# EAGLE design vr (EAGLE 4.16)
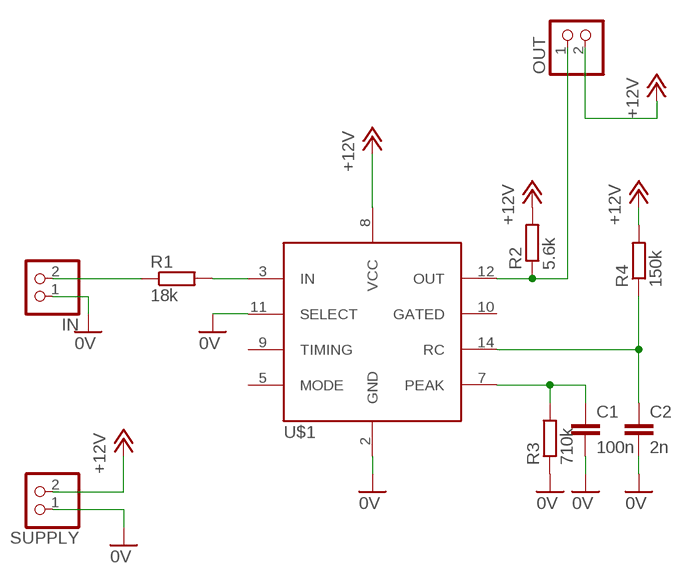
[diagram p0: schematic, sheet 1]

## Parts
C1  100n  C-EU075-032X103  [C075-032X103]
C2  2n  C-EU025-024X044  [C025-024X044]
IN  PINHD-1X2  [1X02]
OUT  PINHD-1X2  [1X02]
R1  18k  R-EU_0204/5  [0204/5]
R2  5.6k  R-EU_0207/10  [0207/10]
R3  710k  R-EU_0204/7  [0204/7]
R4  150k  R-EU_0204/7  [0204/7]
SUPPLY  PINHD-1X2  [1X02]
U$1  LM1815  [DIL14]

## Nets
0V: C1.2 C2.2 IN.1 R3.1 SUPPLY.1 U$1.2(GND) U$1.11(SELECT)
+12V: OUT.2 R2.2 R4.2 SUPPLY.2 U$1.8(VCC)
N$1: R1.2 U$1.3(IN)
N$2: OUT.1 R2.1 U$1.12(OUT)
N$3: C1.1 R3.2 U$1.7(PEAK)
N$5: C2.1 R4.1 U$1.14(RC)
N$6: IN.2 R1.1
Unconnected: U$1.5(MODE) U$1.9(TIMING) U$1.10(GATED)

## Library data of the parts
C1 C2 = rcl:C-EU: CAPACITOR, European symbol
IN OUT SUPPLY = pinhead:PINHD-1X2: PIN HEADER
R1-R4 = rcl:R-EU_: RESISTOR, European symbol
U$1 = rnie04:LM1815

## Board
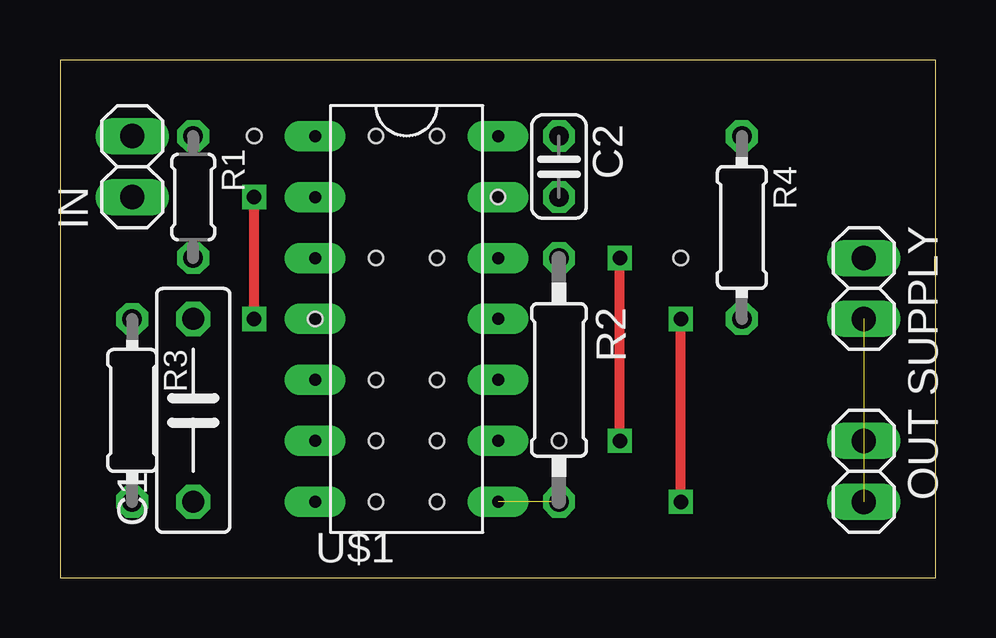
[diagram p1: board, top side]
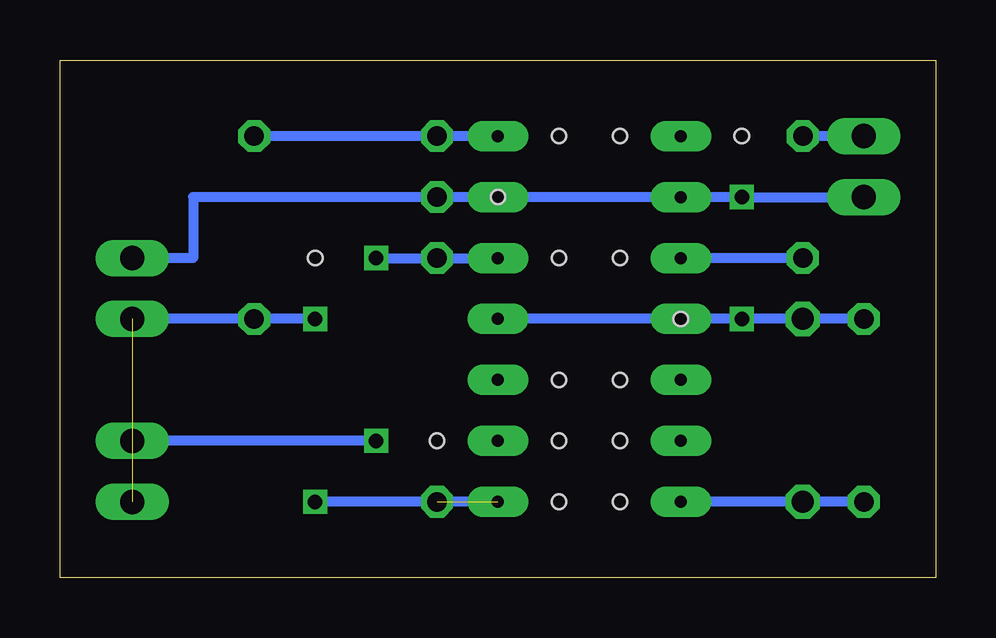
[diagram p2: board, bottom side, seen from below]

Size 36.5 x 21.58 mm. Coordinates in mm from the lower left corner, seen from the top.
Outline: 0,0 36.5,0 36.5,21.58 0,21.58 0,0
Copper layers (1*16): Top 0.035mm / dielectric 1.5mm / Bottom 0.035mm
Design rules "default": minimum track width 10mil, minimum drill 24mil, track to track 8mil, track to pad 8mil, pad to pad 8mil, via to via 8mil, smd to smd 8mil, copper to edge 40mil, drill to drill 8mil, minimum pad ring 10mil, minimum via ring 8mil, stop-mask expansion 4mil, vias tented up to drill 0mil, thermal gap 10mil
Holes 0.6 mm at 13.17,3.17 13.17,5.71 13.17,8.25 13.17,13.33 13.17,18.41 15.71,18.41 15.71,13.33 15.71,8.25 15.71,5.71 15.71,3.17 25.87,13.33 20.79,5.71 18.25,15.87 10.63,10.79 8.09,18.41

### Footprints (pad centres in the part's own frame; a part is rotated, then mirrored left to right if it is on the bottom)
C075-032X103 = drill 0.914 octagon: 1 -3.81,0; 2 3.81,0
C025-024X044 = drill 0.813 octagon: 1 -1.27,0; 2 1.27,0
1X02 = drill 1.016 long: 1 -1.27,0; 2 1.27,0
0204/5 = drill 0.813 octagon: 1 -2.54,0; 2 2.54,0
0207/10 = drill 0.813 octagon: 1 -5.08,0; 2 5.08,0
0204/7 = drill 0.813 octagon: 1 -3.81,0; 2 3.81,0
DIL14 = drill 0.5 pad 1.27 long: 1 -3.81,7.62; 2 -3.81,5.08; 3 -3.81,2.54; 4 -3.81,0; 5 -3.81,-2.54; 6 -3.81,-5.08; 7 -3.81,-7.62; 8 3.81,-7.62; 9 3.81,-5.08; 10 3.81,-2.54; 11 3.81,0; 12 3.81,2.54; 13 3.81,5.08; 14 3.81,7.62

### Placement (x,y rotation side)
C1  5.55,6.98 90 top
C2  20.79,17.14 270 top
IN  3.01,17.14 90 top
OUT  33.49,4.44 270 top
R1  5.55,15.87 270 top
R2  20.79,8.25 270 top
R3  3.01,6.98 270 top
R4  28.41,14.6 270 top
SUPPLY  33.49,12.06 270 top
U$1  14.44,10.79 0 top

### Tracks (layer width: path | path; a pad name or v marks a point on that pad's centre or on a via)
0V  (via drill 0.6)
  Top 0.406: v8.09,10.79 v8.09,15.87
  Bottom 0.406: R3.1 C1.2 v8.09,10.79 U$1.11 | IN.1 v8.09,15.87 U$1.2 C2.2 30.95,15.87 30.95,13.33 SUPPLY.1
+12V  (via drill 0.6)  (2 unrouted)
  Top 0.406: v25.87,3.17 v25.87,10.79
  Bottom 0.406: v25.87,10.79 R4.2 | R4.2 SUPPLY.2 | U$1.8 v25.87,3.17 | R4.2 SUPPLY.2 | R4.2 SUPPLY.2
N$1
  Bottom 0.406: R1.2 U$1.3
N$2  (via drill 0.6)
  Top 0.406: v23.33,5.71 v23.33,13.33
  Bottom 0.406: U$1.12 R2.1 v23.33,13.33 | v23.33,5.71 OUT.1
N$3
  Bottom 0.406: U$1.7 C1.1 R3.2
N$5
  Bottom 0.406: C2.1 U$1.14 C2.1 | C2.1 R4.1
N$6
  Bottom 0.406: IN.2 R1.1